# EAGLE board sparrow (EAGLE 6.5.0), part 1 of 2
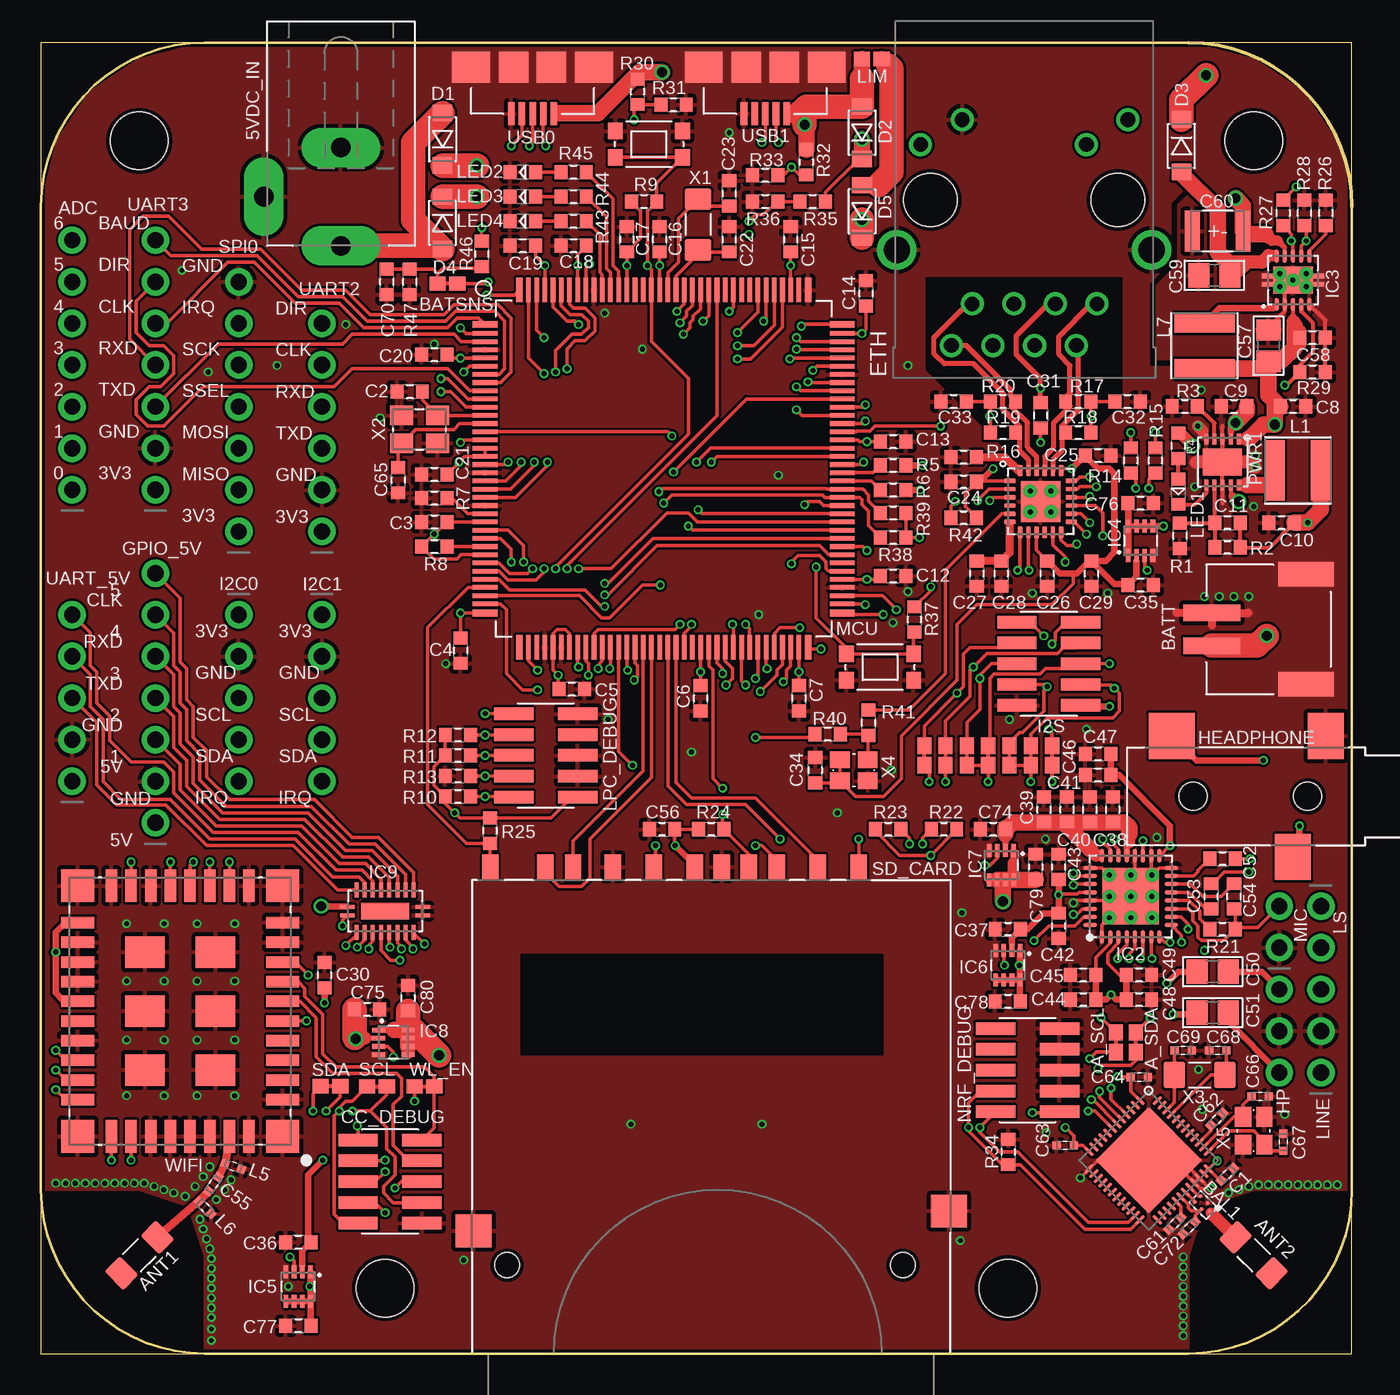
[diagram p10: board, top side]
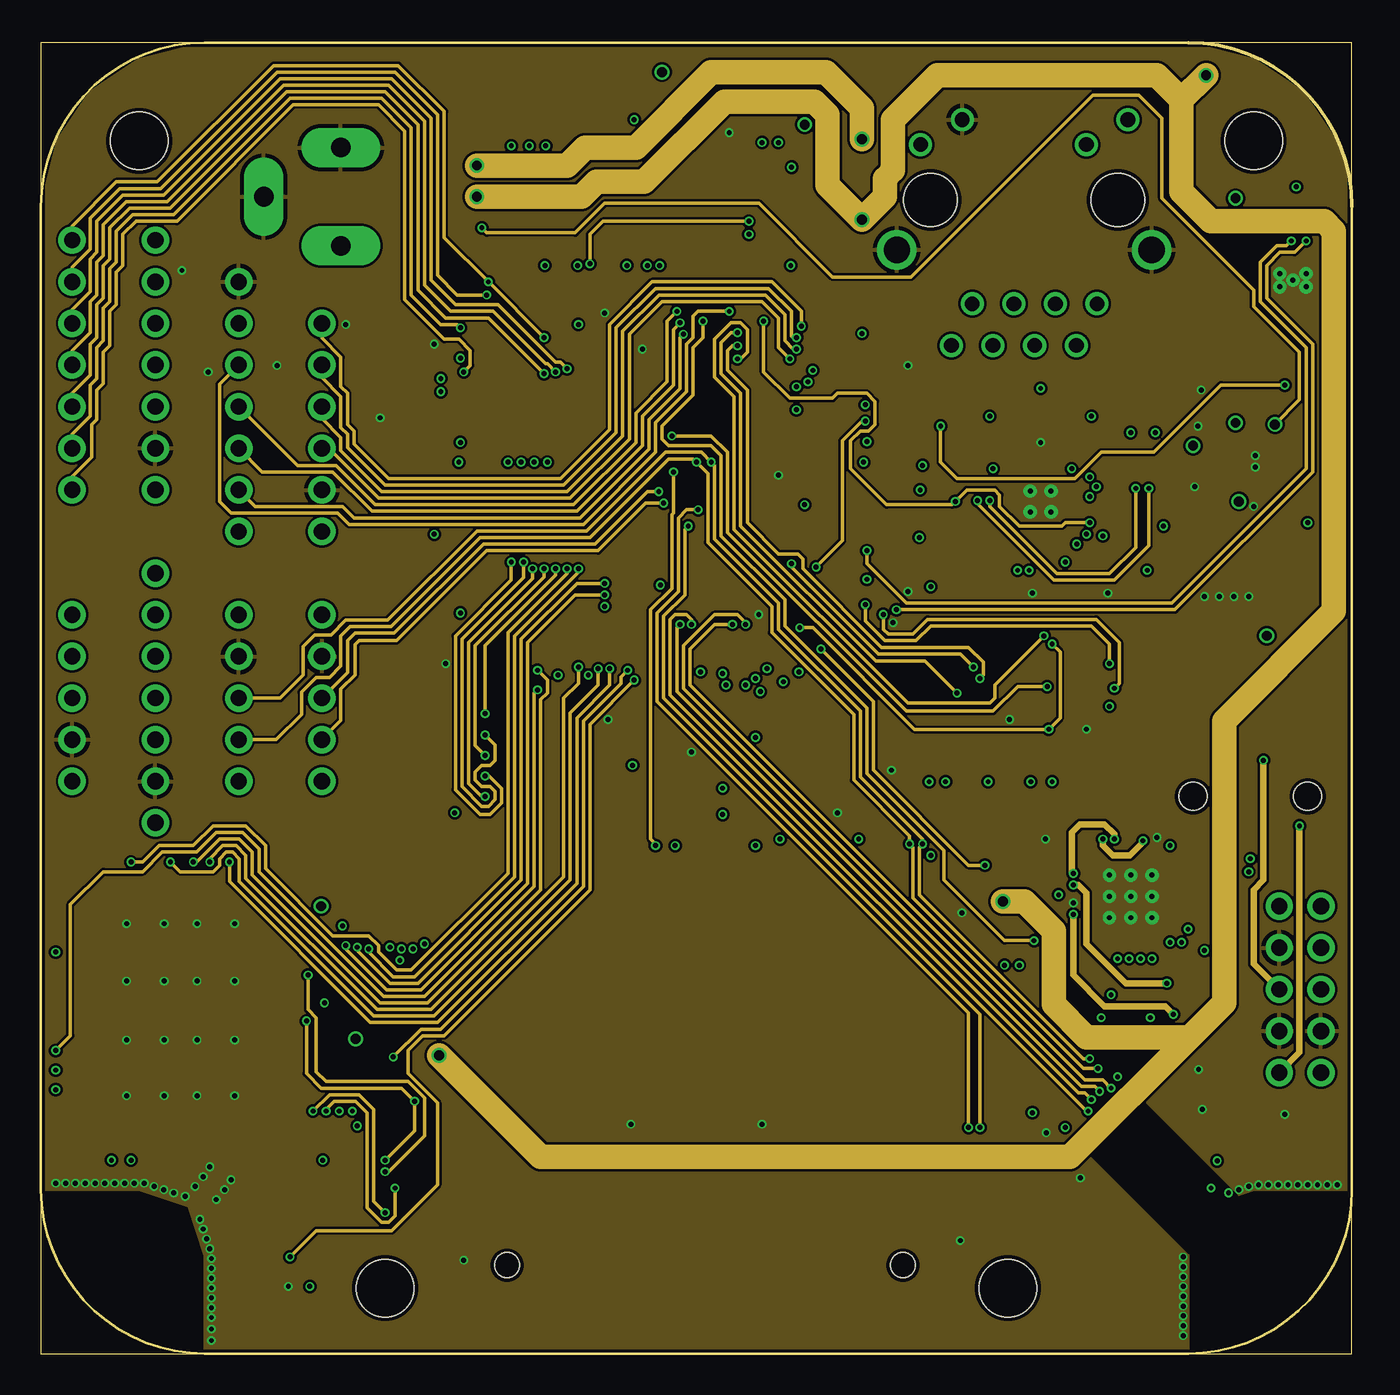
[diagram p11: board, inner layer Route2]
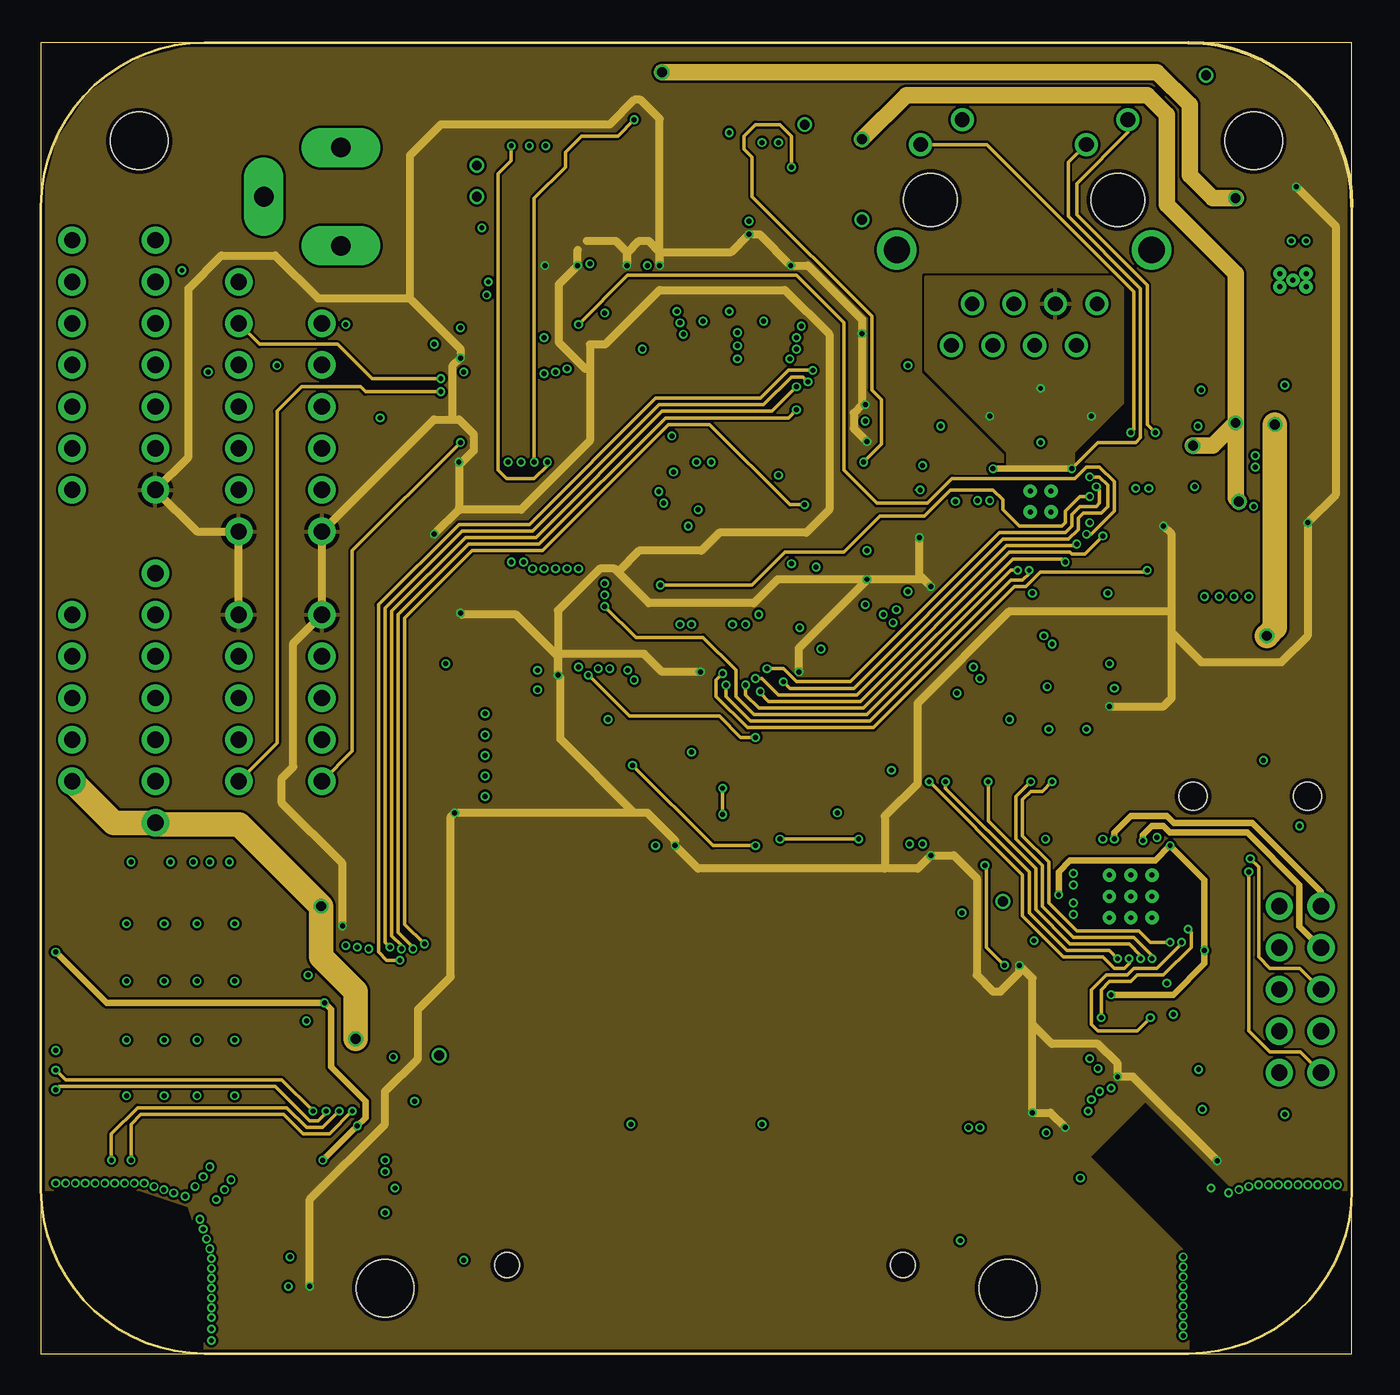
[diagram p12: board, inner layer Route15]
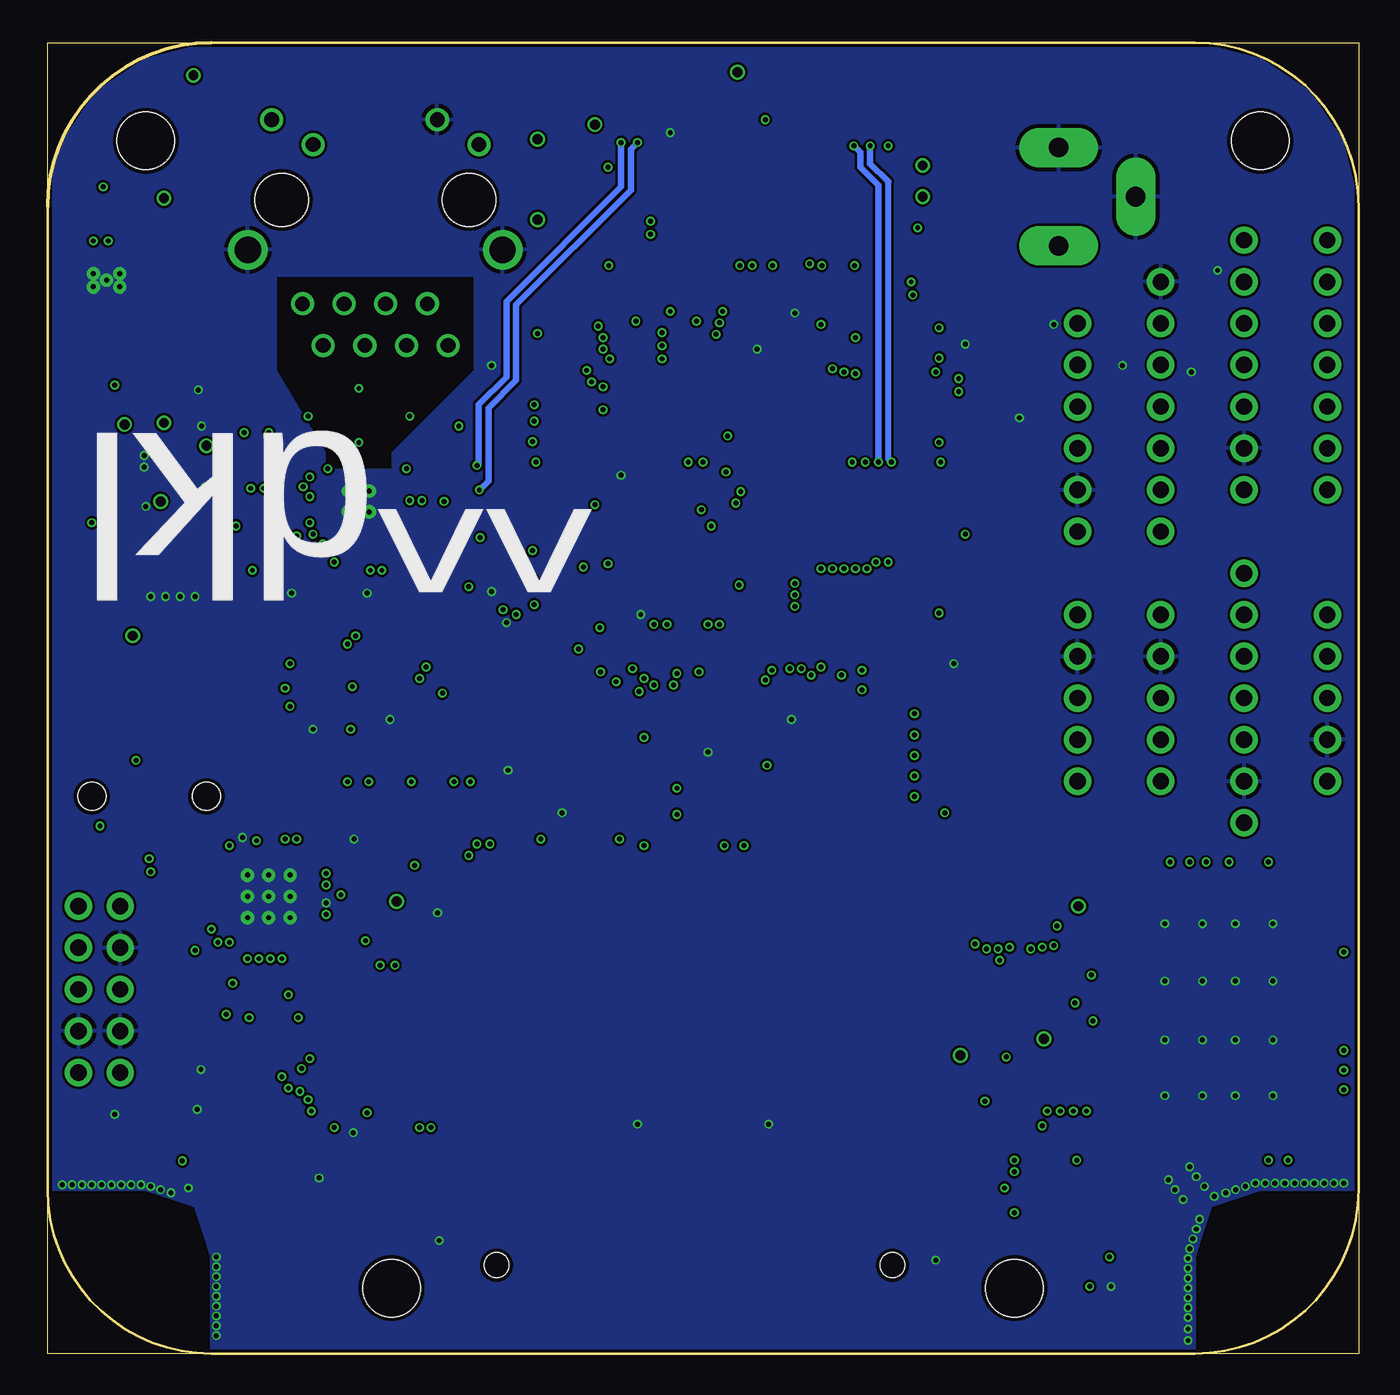
[diagram p13: board, bottom side, seen from below]

Size 80 x 80 mm. Coordinates in mm from the lower left corner, seen from the top.
Outline: 0,0 80,0 80,80 0,80 0,0
Copper layers (1+2*15+16): Top 0.035mm / dielectric 0.2mm / Route2 0.035mm / dielectric 0.55mm / Route15 0.035mm / dielectric 0.2mm / Bottom 0.035mm
Design rules "default *": minimum track width 0.15mm, minimum drill 0.3mm, track to track 0.15mm, track to pad 0.15mm, pad to pad 0.15mm, via to via 0.15mm, smd to smd 0.15mm, copper to edge 10mil, drill to drill 8mil, minimum pad ring 10mil, minimum via ring 4.5mil, stop-mask expansion 3mil, vias tented up to drill 0.61mm, thermal gap 10mil
Net classes: 1 supply2000: width 0.2 mm, drill 0.3 mm; 2 supply500: width 0.2 mm, drill 0.3 mm
Holes 3.5 mm at 6,74 59,4 21,4 74,74
Milling: 8 lines

## Footprints (pad centres in the part's own frame; a part is rotated, then mirrored left to right if it is on the bottom)
CUI_PJ_102BH = drill 1.2 pad 2.4 long: 1 -3,0; 2 0,-4.699; 3 3,0
CK-KMR2 = smd 1 x 0.9: P$1 -0.8,2.05; P$2 -0.8,-2.05; P$3 0.8,2.05; P$4 0.8,-2.05
0603_SOLDERJUMPER_CLOSED = smd 1 x 0.86: 1 -0.6,0; 2 0.6,0
1X07_ROUND = drill 1 pad 1.676: 1 -7.62,0; 2 -5.08,0; 3 -2.54,0; 4 0,0; 5 2.54,0; 6 5.08,0; 7 7.62,0
1206_MINIMELF_COMBO = smd 1.3 x 1.6: 1 -1.55,0; 2 1.55,0
ST_BAL_WLCSP = smd 0.25 x 0.25: DIFF1 -0.6,0.25; DIFF2 -0.6,-0.25; GND 0,0.25; SE 0.433,0; VCC 0,-0.25
S2B-PH-SM4-TB = smd 1 x 3.5: 1 1,-4.25; 2 -1,-4.25 | smd 1.5 x 3.4: 3 -3.35,1.5; 4 3.35,1.5
0402 = smd 0.5 x 0.5: P$1 -0.525,0; P$2 0.525,0
0603 = smd 0.787 x 0.864: 1 -0.775,0; 2 0.775,0
0805 = smd 1.3 x 1.5: 1 -0.95,0; 2 0.95,0
1210_POLAR = smd 0.9 x 2.5: A -1.55,0; K 1.55,0
2X05_SMT = smd 0.762 x 2.4: 1 -2.54,-1.95; 2 -2.54,1.95; 3 -1.27,-1.95; 4 -1.27,1.95; 5 0,-1.95; 6 0,1.95; 7 1.27,-1.95; 8 1.27,1.95; 9 2.54,-1.95; 10 2.54,1.95
SOD123FL = smd 1 x 1.2: A -1.6,0; K 1.6,0
RJ45-RB1-125BAG1A = drill 1.6: CHASSIS@1 -7.775,3.05; CHASSIS@2 7.775,3.05 | drill 0.9: L1 6.325,-3.38; L2 3.785,-4.9; L3 -3.785,-3.38; L4 -6.325,-4.9; R1 -4.445,6.34; R2 -3.175,8.88; R3 -1.905,6.34; R4 -0.635,8.88; R5 0.635,6.34; R6 1.905,8.88; R7 3.175,6.34; R8 4.445,8.88 | hole 3.25: -5.715,0; 5.715,0
CUI_SJ_3523_SMT = smd 2.2 x 2.8: 1 -1.1,-3.7; 3 0.9,3.7 | smd 2.8 x 2.8: 2 8.3,-3.7 | hole 1.7: 0,0; 7,0
1X03_ROUND = drill 1 pad 1.676: 1 -2.54,0; 2 0,0; 3 2.54,0
1X05_ROUND = drill 1 pad 1.676: 1 -5.08,0; 2 -2.54,0; 3 0,0; 4 2.54,0; 5 5.08,0
QFN24-0.5-EP-VIAS = smd 0.69 x 0.28: 1 -1.883,1.25; 2 -1.883,0.75; 3 -1.883,0.25; 4 -1.883,-0.25; 5 -1.883,-0.75; 6 -1.883,-1.25; 13 1.883,-1.25; 14 1.883,-0.75; 15 1.883,-0.25; 16 1.883,0.25; 17 1.883,0.75; 18 1.883,1.25 | smd 0.28 x 0.69: 7 -1.25,-1.883; 8 -0.75,-1.883; 9 -0.25,-1.883; 10 0.25,-1.883; 11 0.75,-1.883; 12 1.25,-1.883; 19 1.25,1.883; 20 0.75,1.883; 21 0.25,1.883; 22 -0.25,1.883; 23 -0.75,1.883; 24 -1.25,1.883 | drill 0.3: P$1 0.635,0.635; P$2 -0.635,0.635; P$3 -0.635,-0.635; P$4 0.635,-0.635 | smd 2.5 x 2.5: PAD 0,0
QFN32-0.5-EP-VIAS = smd 0.85 x 0.28: 1 -2.475,1.75; 2 -2.475,1.25; 3 -2.475,0.75; 4 -2.475,0.25; 5 -2.475,-0.25; 6 -2.475,-0.75; 7 -2.475,-1.25; 8 -2.475,-1.75; 17 2.475,-1.75; 18 2.475,-1.25; 19 2.475,-0.75; 20 2.475,-0.25; 21 2.475,0.25; 22 2.475,0.75; 23 2.475,1.25; 24 2.475,1.75 | smd 0.28 x 0.85: 9 -1.75,-2.475; 10 -1.25,-2.475; 11 -0.75,-2.475; 12 -0.25,-2.475; 13 0.25,-2.475; 14 0.75,-2.475; 15 1.25,-2.475; 16 1.75,-2.475; 25 1.75,2.475; 26 1.25,2.475; 27 0.75,2.475; 28 0.25,2.475; 29 -0.25,2.475; 30 -0.75,2.475; 31 -1.25,2.475; 32 -1.75,2.475 | smd 3.45 x 3.45: PAD 0,0 | drill 0.3: VIA1 -1.3,1.3; VIA2 0,1.3; VIA3 1.3,1.3; VIA4 -1.3,0; VIA5 0,0; VIA6 1.3,0; VIA7 -1.3,-1.3; VIA8 0,-1.3; VIA9 1.3,-1.3
SON10-0.5-EP-VIAS = smd 0.23 x 0.8: 1 -1,-1.475; 2 -0.5,-1.475; 3 0,-1.475; 4 0.5,-1.475; 5 1,-1.475; 6 1,1.475; 7 0.5,1.475; 8 0,1.475; 9 -0.5,1.475; 10 -1,1.475 | smd 0.7 x 0.28: EXT1 -1.55,0.25; EXT2 1.55,0.25; EXT3 -1.55,-0.25; EXT4 1.55,-0.25 | smd 2.4 x 1.65: PAD 0,0 | drill 0.3: THERM1 -0.8,0.4; THERM2 0.8,0.4; THERM3 0,0; THERM4 -0.8,-0.4; THERM5 0.8,-0.4
SC70JW-8-NOTHERMALS = smd 0.8 x 0.28: 1 -0.9,0.75; 2 -0.9,0.25; 3 -0.9,-0.25; 4 -0.9,-0.75; 5 0.9,-0.75; 6 0.9,-0.25; 7 0.9,0.25; 8 0.9,0.75
FXMA108 = smd 0.9 x 0.24: 1 -2.3,-0.25; 10 2.3,-0.25; 11 2.3,0.25; 20 -2.3,0.25 | smd 0.24 x 0.9: 2 -1.75,-1.3; 3 -1.25,-1.3; 4 -0.75,-1.3; 5 -0.25,-1.3; 6 0.25,-1.3; 7 0.75,-1.3; 8 1.25,-1.3; 9 1.75,-1.3; 12 1.75,1.3; 13 1.25,1.3; 14 0.75,1.3; 15 0.25,1.3; 16 -0.25,1.3; 17 -0.75,1.3; 18 -1.25,1.3; 19 -1.75,1.3 | smd 2.9 x 1: EP 0,0
INDUCTOR_40X40 = smd 1.2 x 3.7: P$1 -1.4,0; P$2 1.4,0
0603_POLAR = smd 0.787 x 0.864: A -0.775,0; K 0.775,0
0603_SOLDERJUMPER_OPEN = smd 1 x 0.86: 1 -0.6,0; 2 0.6,0
1X02_ROUND = drill 1 pad 1.676: 1 -1.27,0; 2 1.27,0
QFP144-0.5 = smd 1.5 x 0.4: 1 -10.9,8.81; 36 -10.9,-8.81; 73 10.9,-8.81; 108 10.9,8.81 | smd 1.5 x 0.28: 2 -10.9,8.25; 3 -10.9,7.75; 4 -10.9,7.25; 5 -10.9,6.75; 6 -10.9,6.25; 7 -10.9,5.75; 8 -10.9,5.25; 9 -10.9,4.75; 10 -10.9,4.25; 11 -10.9,3.75; 12 -10.9,3.25; 13 -10.9,2.75; 14 -10.9,2.25; 15 -10.9,1.75; 16 -10.9,1.25; 17 -10.9,0.75; 18 -10.9,0.25; 19 -10.9,-0.25; 20 -10.9,-0.75; 21 -10.9,-1.25; 22 -10.9,-1.75; 23 -10.9,-2.25; 24 -10.9,-2.75; 25 -10.9,-3.25; 26 -10.9,-3.75; 27 -10.9,-4.25; 28 -10.9,-4.75; 29 -10.9,-5.25; 30 -10.9,-5.75; 31 -10.9,-6.25; 32 -10.9,-6.75; 33 -10.9,-7.25; 34 -10.9,-7.75; 35 -10.9,-8.25; 74 10.9,-8.25; 75 10.9,-7.75; 76 10.9,-7.25; 77 10.9,-6.75; 78 10.9,-6.25; 79 10.9,-5.75; 80 10.9,-5.25; 81 10.9,-4.75; 82 10.9,-4.25; 83 10.9,-3.75; 84 10.9,-3.25; 85 10.9,-2.75; 86 10.9,-2.25; 87 10.9,-1.75; 88 10.9,-1.25; 89 10.9,-0.75; 90 10.9,-0.25; 91 10.9,0.25; 92 10.9,0.75; 93 10.9,1.25; 94 10.9,1.75; 95 10.9,2.25; 96 10.9,2.75; 97 10.9,3.25; 98 10.9,3.75; 99 10.9,4.25; 100 10.9,4.75; 101 10.9,5.25; 102 10.9,5.75; 103 10.9,6.25; 104 10.9,6.75; 105 10.9,7.25; 106 10.9,7.75; 107 10.9,8.25 | smd 0.4 x 1.5: 37 -8.81,-10.9; 72 8.81,-10.9; 109 8.81,10.9; 144 -8.81,10.9 | smd 0.28 x 1.5: 38 -8.25,-10.9; 39 -7.75,-10.9; 40 -7.25,-10.9; 41 -6.75,-10.9; 42 -6.25,-10.9; 43 -5.75,-10.9; 44 -5.25,-10.9; 45 -4.75,-10.9; 46 -4.25,-10.9; 47 -3.75,-10.9; 48 -3.25,-10.9; 49 -2.75,-10.9; 50 -2.25,-10.9; 51 -1.75,-10.9; 52 -1.25,-10.9; 53 -0.75,-10.9; 54 -0.25,-10.9; 55 0.25,-10.9; 56 0.75,-10.9; 57 1.25,-10.9; 58 1.75,-10.9; 59 2.25,-10.9; 60 2.75,-10.9; 61 3.25,-10.9; 62 3.75,-10.9; 63 4.25,-10.9; 64 4.75,-10.9; 65 5.25,-10.9; 66 5.75,-10.9; 67 6.25,-10.9; 68 6.75,-10.9; 69 7.25,-10.9; 70 7.75,-10.9; 71 8.25,-10.9; 110 8.25,10.9; 111 7.75,10.9; 112 7.25,10.9; 113 6.75,10.9; 114 6.25,10.9; 115 5.75,10.9; 116 5.25,10.9; 117 4.75,10.9; 118 4.25,10.9; 119 3.75,10.9; 120 3.25,10.9; 121 2.75,10.9; 122 2.25,10.9; 123 1.75,10.9; 124 1.25,10.9; 125 0.75,10.9; 126 0.25,10.9; 127 -0.25,10.9; 128 -0.75,10.9; 129 -1.25,10.9; 130 -1.75,10.9; 131 -2.25,10.9; 132 -2.75,10.9; 133 -3.25,10.9; 134 -3.75,10.9; 135 -4.25,10.9; 136 -4.75,10.9; 137 -5.25,10.9; 138 -5.75,10.9; 139 -6.25,10.9; 140 -6.75,10.9; 141 -7.25,10.9; 142 -7.75,10.9; 143 -8.25,10.9
QFN48_EP = smd 0.7 x 0.2: 1 -2.95,2.2; 2 -2.95,1.8; 3 -2.95,1.4; 4 -2.95,1; 5 -2.95,0.6; 6 -2.95,0.2; 7 -2.95,-0.2; 8 -2.95,-0.6; 9 -2.95,-1; 10 -2.95,-1.4; 11 -2.95,-1.8; 12 -2.95,-2.2; 25 2.95,-2.2; 26 2.95,-1.8; 27 2.95,-1.4; 28 2.95,-1; 29 2.95,-0.6; 30 2.95,-0.2; 31 2.95,0.2; 32 2.95,0.6; 33 2.95,1; 34 2.95,1.4; 35 2.95,1.8; 36 2.95,2.2 | smd 0.2 x 0.7: 13 -2.2,-2.95; 14 -1.8,-2.95; 15 -1.4,-2.95; 16 -1,-2.95; 17 -0.6,-2.95; 18 -0.2,-2.95; 19 0.2,-2.95; 20 0.6,-2.95; 21 1,-2.95; 22 1.4,-2.95; 23 1.8,-2.95; 24 2.2,-2.95; 37 2.2,2.95; 38 1.8,2.95; 39 1.4,2.95; 40 1,2.95; 41 0.6,2.95; 42 0.2,2.95; 43 -0.2,2.95; 44 -0.6,2.95; 45 -1,2.95; 46 -1.4,2.95; 47 -1.8,2.95; 48 -2.2,2.95 | smd 4.6 x 4.6: PAD 0,0
LTC4080_DFN = smd 0.675 x 0.25: 1 -1.413,1; 2 -1.413,0.5; 3 -1.413,0; 4 -1.413,-0.5; 5 -1.413,-1; 6 1.413,-1; 7 1.413,-0.5; 8 1.413,0; 9 1.413,0.5; 10 1.413,1 | smd 1.65 x 2.38: 11 0,0
AMPHENO_101_00313_EXT_PADS = smd 1.5 x 1: 1 -24.31,6.1; 2 -24.31,3.6; 3 -24.31,0.25; 4 -24.31,-1.4; 5 -24.31,-3.9; 6 -24.31,-6.4; 7 -24.31,-8.83; 8 -24.31,-10.53; 9 -24.31,8.6; CD -24.31,1.9; WP -24.31,-13.88 | smd 2 x 2.2: GND1 -2.1,-14.9; GND2 -3.3,14.1 | hole 1.5: 0,11.3; 0,-12.85
1X06_ROUND = drill 1 pad 1.676: 1 -6.35,0; 2 -3.81,0; 3 -1.27,0; 4 1.27,0; 5 3.81,0; 6 6.35,0
USB_MICRO_SMD = smd 0.4 x 1.4: 1_VBUS -1.3,2.85; 2_D- -0.65,2.85; 3_D+ 0,2.85; 4_ID_NC 0.65,2.85; 5_GND 1.3,2.85 | smd 2.3 x 1.9: SHIELD_1 -3.75,0; SHIELD_4 3.75,0 | smd 1.8 x 1.9: SHIELD_2 -1.15,0; SHIELD_3 1.15,0
CC3000-EXT = smd 2 x 0.7: 1 -6.25,5.4; 2 -6.25,4.2; 3 -6.25,3; 4 -6.25,1.8; 5 -6.25,0.6; 6 -6.25,-0.6; 7 -6.25,-1.8; 8 -6.25,-3; 9 -6.25,-4.2; 10 -6.25,-5.4; 19 6.25,-5.4; 20 6.25,-4.2; 21 6.25,-3; 22 6.25,-1.8; 23 6.25,-0.6; 24 6.25,0.6; 25 6.25,1.8; 26 6.25,3; 27 6.25,4.2; 28 6.25,5.4 | smd 0.7 x 2: 11 -4.2,-7.65; 12 -3,-7.65; 13 -1.8,-7.65; 14 -0.6,-7.65; 15 0.6,-7.65; 16 1.8,-7.65; 17 3,-7.65; 18 4.2,-7.65; 29 4.2,7.65; 30 3,7.65; 31 1.8,7.65; 32 0.6,7.65; 33 -0.6,7.65; 34 -1.8,7.65; 35 -3,7.65; 36 -4.2,7.65 | smd 2.4 x 1.9: 37 -2.15,3.6; 38 -2.15,0; 39 -2.15,-3.6; 40 2.15,3.6; 41 2.15,0; 42 2.15,-3.6 | smd 2 x 2: 43 -6.25,7.65; 44 -6.25,-7.65; 45 6.25,-7.65; 46 6.25,7.65
ABM8G = smd 1.397 x 1.194: 1 -1.105,-0.851; 2 1.105,-0.851; 3 1.105,0.851; 4 -1.105,0.851
CRYSTAL25X20 = smd 1.2 x 1: 1 -0.85,-0.65; 2 0.85,-0.65; 3 0.85,0.65; 4 -0.85,0.65

## Placement (x,y rotation side)
5VDC_IN  2A max  [CUI_PJ_102BH]  18.3,70.6 270 top
!PGM  PUSHBUTTONKMR2XX  [CK-KMR2]  51.2,41.9 90 top
A_SCL  JUMPERSOLDER_CLOSED  [0603_SOLDERJUMPER_CLOSED]  65.6,19 90 top
A_SDA  JUMPERSOLDER_CLOSED  [0603_SOLDERJUMPER_CLOSED]  66.8,19 90 top
ADC  HEADER-1X7ROUND  [1X07_ROUND]  1.91,60.33 90 top
ANT1  2.4GHz 50Ω  [1206_MINIMELF_COMBO]  6,6 225 top
ANT2  2.4GHz 50Ω  [1206_MINIMELF_COMBO]  74,6 315 top
BAL1  BALUNWLCSP  [ST_BAL_WLCSP]  71,9 315 top
BATSNS  JUMPERSOLDER_CLOSED  [0603_SOLDERJUMPER_CLOSED]  24.8,65.3 180 top
BATT  BATTERY_WITH_HOLDER  [S2B-PH-SM4-TB]  75.7,44.2 270 top
C1  1n  [0402]  72.4,10.94 45 top
C2  18p  [0603]  22.5,58.7 180 top
C3  100n  [0603]  24,50.75 180 top
C4  100n  [0603]  25.61,42.9 270 top
C5  100n  [0603]  32.4,40.55 0 top
C6  100n  [0603]  40.25,40 270 top
C7  100n  [0603]  46.25,40 270 top
C8  4.7u  [0603]  76.4,57.8 0 top
C9  4.7u  [0603]  72.8,57.8 180 top
C10  4.7u  [0603]  75.7,50.7 180 top
C11  10p  [0603]  72.4,50.7 180 top
C12  100n  [0603]  52,47.45 0 top
C13  100n  [0603]  52,55.65 0 top
C14  100n  [0603]  50.35,64.7 90 top
C15  100n  [0603]  45.75,68 90 top
C16  100n  [0603]  37.75,68 90 top
C17  100n  [0603]  35.75,68 90 top
C18  100n  [0603]  32.5,67.6 180 top
C19  100n  [0603]  29.4,67.6 180 top
C20  100n  [0603]  24,60.95 180 top
C21  100n  [0603]  24,53.65 180 top
C22  18p  [0603]  42,68 90 top
C23  18p  [0603]  42,70.8 90 top
C24  10n  [0603]  56.3,53.2 180 top
C25  10n  [0603]  64.5,54.8 0 top
C26  10n  [0603]  61.4,47.6 270 top
C27  1u  [0603]  57.1,47.6 270 top
C28  470p  [0603]  58.6,47.6 270 top
C29  10u  [0603]  64.1,47.6 270 top
C30  100n  [0603]  17.3,23.1 90 top
C31  100n  [0603]  61,57.25 270 top
C32  100n  [0603]  66.3,58.1 0 top
C33  100n  [0603]  55.7,58.1 180 top
C34  100n  [0603]  47.25,35.6 90 top
C35  100n  [0603]  67.1,46.9 0 top
C36  100n  [0603]  15.7,6.8 180 top
C37  100n  [0603]  59,25.9 180 top
C38  100n  [0603]  65.4,33.2 90 top
C39  100n  [0603]  61.2,33.2 90 top
C40  22u  [0603]  64,33.2 90 top
C41  22u  [0603]  62.6,33.2 90 top
C42  10u  [0603]  62.1,26.1 270 top
C43  100n  [0603]  62.1,29.7 90 top
C44  10u  [0603]  63.6,21.6 180 top
C45  100n  [0603]  63.6,23.1 180 top
C46  10u  [0603]  64.5,35.3 180 top
C47  100n  [0603]  64.5,36.6 180 top
C48  10u  [0603]  67,21.6 0 top
C49  100n  [0603]  67,23.1 0 top
C50  47u  [0805]  71.5,23.3 0 top
C51  47u  [0805]  71.5,20.8 0 top
C52  1u  [0603]  72.1,30.2 180 top
C53  1u  [0603]  71.4,27.9 270 top
C54  100n  [0603]  72.8,27.9 90 top
C55  2.2p  [0402]  10.52,10.34 235 top
C56  1u  [0603]  37.9,32 180 top
C57  22u 10V  [0805]  74.9,61.5 90 top
C58  100n  [0603]  77.6,62 0 top
C59  22u 10V  [0805]  71.6,65.8 180 top
C60  150u 10V  [1210_POLAR]  71.8,68.5 180 top
C61  47n  [0402]  69.2,7.94 225 top
C62  100n  [0402]  71.76,14.3 45 top
C63  100n  [0402]  62.5,12.7 180 top
C64  100n  [0402]  67.02,16.87 0 top
C65  18p  [0603]  21.8,53.3 270 top
C66  12p  [0402]  74.4,15.7 0 top
C67  12p  [0402]  75.8,12.9 90 top
C68  9p  [0402]  71.8,18.5 0 top
C69  9p  [0402]  69.7,18.5 180 top
C70  100n  [0603]  21.1,65.4 270 top
C72  2.2n  [0402]  70.06,7.68 45 top
C74  100n  [0603]  58.1,32 180 top
C75  100n  [0603]  19.9,21 0 top
C76  1u  [0603]  67.1,51.9 0 top
C77  1u  [0603]  15.7,1.7 180 top
C78  1u  [0603]  59,21.5 180 top
C79  1u  [0603]  60.7,29.7 90 top
C80  1u  [0603]  22.4,21.7 90 top
CC_DEBUG  HEADER-2X5SMD-1.27MM  [2X05_SMT]  21.3,10.5 270 top
D1  MBR230LSFT1  [SOD123FL]  24.5,74.1 270 top
D2  MBR230LSFT1  [SOD123FL]  50.1,74.5 270 top
D3  MBR230LSFT1  [SOD123FL]  69.6,73.7 90 top
D4  MBR230LSFT1  [SOD123FL]  24.5,69 90 top
D5  MBR230LSFT1  [SOD123FL]  50.1,69.7 270 top
ETH  ETHERNET_JACK_LEDSRB1-125BAG1A  [RJ45-RB1-125BAG1A]  60,70.4 180 top
GPIO_5V  HEADER-1X7ROUND  [1X07_ROUND]  6.99,40.01 90 top
HEADPHONE  AUDIOJACK-STEREO-3PCUI_SJ_3523  [CUI_SJ_3523_SMT]  77.3,34 180 top
HP  HP  [1X03_ROUND]  75.56,19.68 270 top
I2C0  I2C0  [1X05_ROUND]  12.06,40.01 270 top
I2C1  I2C1  [1X05_ROUND]  17.14,40.01 270 top
I2S  HEADER-2X5SMD-1.27MM  [2X05_SMT]  61.5,42.1 90 top
IC1  LAN8720AVIAS  [QFN24-0.5-EP-VIAS]  61,52 0 top
IC2  TLV320AIC3100VIAS  [QFN32-0.5-EP-VIAS]  66.5,27.9 90 top
IC3  TPS2500  [SON10-0.5-EP-VIAS]  76.4,65.5 0 top
IC4  SKYWORKS_AAT4280ASC70JW-8-NOTHERMALS  [SC70JW-8-NOTHERMALS]  67.1,49.6 90 top
IC5  SKYWORKS_AAT4280ASC70JW-8-NOTHERMALS  [SC70JW-8-NOTHERMALS]  15.7,4.1 270 top
IC6  SKYWORKS_AAT4280ASC70JW-8-NOTHERMALS  [SC70JW-8-NOTHERMALS]  59,23.7 270 top
IC7  SKYWORKS_AAT4280ASC70JW-8-NOTHERMALS  [SC70JW-8-NOTHERMALS]  58.6,29.8 270 top
IC8  SKYWORKS_AAT4280ASC70JW-8-NOTHERMALS  [SC70JW-8-NOTHERMALS]  21.5,19 0 top
IC9  FXMA10820-DFN  [FXMA108]  21,27 0 top
L1  10u  [INDUCTOR_40X40]  76.7,53.9 0 top
L5  2.2n  [0402]  11.73,11.43 160 top
L6  DNP  [0402]  10.01,8.92 135 top
L7  2.2u  [INDUCTOR_40X40]  71,61.5 90 top
LED1  CHARGE  [0603_POLAR]  69.4,52.6 270 top
LED2  [0603_POLAR]  29.4,72.1 180 top
LED3  [0603_POLAR]  29.4,70.6 180 top
LED4  [0603_POLAR]  29.4,69.1 180 top
LIM  JUMPERSOLDER_OPEN  [0603_SOLDERJUMPER_OPEN]  50.7,79 0 top
LINE  LINE  [1X03_ROUND]  78.11,19.68 90 top
LOGO2  LOGOKRONE  [LOGO-KRONE]  50.6,30 180 bottom
LOGO3  LOGOKRONE  [LOGO-KRONE]  31.6,30 180 bottom
LOGO4  LOGOKRONE  [LOGO-KRONE]  12.6,30 180 bottom
LPC_DEBUG  DEBUG  [2X05_SMT]  30.8,36.5 90 top
LS  LS  [1X02_ROUND]  78.11,26.04 270 top
MCLK  JUMPERSOLDER_CLOSED  [0603_SOLDERJUMPER_CLOSED]  61.7,36.5 270 top
MCU  LPC1837  [QFP144-0.5]  38,54 0 top
MCU1  NRF51822QFN48  [QFN48_EP]  67.6,11.8 315 top
MIC  MIC  [1X02_ROUND]  75.56,26.04 90 top
NRF_DEBUG  HEADER-2X5SMD-1.27MM  [2X05_SMT]  60.2,17.3 90 top
PWR1  LTC4080DFN  [LTC4080_DFN]  72.1,54.4 270 top
R1  768K  [0603]  69.5,49.9 90 top
R2  2.4M  [0603]  72.4,49.2 0 top
R3  806  [0603]  69.8,57.8 0 top
R4  1K  [0603]  69.4,55.4 90 top
R5  33  [0603]  52,54.2 0 top
R6  33  [0603]  52,52.7 0 top
R7  12K 1%  [0603]  24,52.2 180 top
R8  10K  [0603]  24,49.25 180 top
R9  10K  [0603]  36.8,70.3 180 top
R10  10K  [0603]  25.45,34 180 top
R11  10K  [0603]  25.45,36.5 180 top
R12  10K  [0603]  25.45,37.75 180 top
R13  10K  [0603]  25.45,35.25 0 top
R14  330  [0603]  66.5,54.5 270 top
R15  330  [0603]  68,54.5 270 top
R16  12.1K  [0603]  56.3,54.7 0 top
R17  49.9 1%  [0603]  63.3,58.1 0 top
R18  49.9 1%  [0603]  63.3,56.2 180 top
R19  49.9 1%  [0603]  58.7,56.2 180 top
R20  49.9 1%  [0603]  58.7,58.1 0 top
R21  2.2K  [0603]  72.1,25.9 180 top
R22  2.2K  [0603]  55.1,32 0 top
R23  2.2K  [0603]  51.7,32 180 top
R24  100K  [0603]  40.9,32 180 top
R25  100K  [0603]  27.4,31.9 90 top
R26  40.2K  [0603]  78.4,69.6 270 top
R27  100K  [0603]  75.8,69.6 90 top
R28  100K  [0603]  77.1,69.6 270 top
R29  100K  [0603]  77.6,59.9 180 top
R30  10K  [0603]  36.4,77 90 top
R31  100K  [0603]  38.6,76.2 180 top
R32  10K  [0603]  46.7,72.7 90 top
R33  100K  [0603]  44.2,71.9 0 top
R34  100K  [0603]  59.02,12.31 270 top
R35  100K  [0603]  47.1,70.3 0 top
R36  100K  [0603]  44.2,70.3 0 top
R37  100K  [0603]  53.3,44.8 90 top
R38  2.2K  [0603]  52,49.8 0 top
R39  2.2K  [0603]  52,51.3 0 top
R40  33  [0603]  48,37.8 0 top
R41  33  [0603]  50.5,38.5 90 top
R42  10K  [0603]  56.3,51 0 top
R43  1K  [0603]  32.5,70.6 180 top
R44  1K  [0603]  32.5,69.1 180 top
R45  1K  [0603]  32.5,72.1 180 top
R46  768K  [0603]  26.9,67.1 90 top
R47  768K  [0603]  22.5,65.4 90 top
RESET  PUSHBUTTONKMR2XX  [CK-KMR2]  37.1,73.8 270 top
RX_SCK  JUMPERSOLDER_CLOSED  [0603_SOLDERJUMPER_CLOSED]  60.4,36.5 270 top
RX_SD  JUMPERSOLDER_CLOSED  [0603_SOLDERJUMPER_CLOSED]  55.2,36.5 270 top
RX_WS  JUMPERSOLDER_CLOSED  [0603_SOLDERJUMPER_CLOSED]  57.8,36.5 270 top
SCL  [0603_SOLDERJUMPER_CLOSED]  20.5,16.3 180 top
SD_CARD  SD_CARDEXTENDED  [AMPHENO_101_00313_EXT_PADS]  41.3,5.4 270 top
SDA  JUMPERSOLDER_CLOSED  [0603_SOLDERJUMPER_CLOSED]  17.66,16.32 180 top
SPI0  HEADER-1X7ROUND  [1X07_ROUND]  12.06,57.78 90 top
TX_SCK  JUMPERSOLDER_CLOSED  [0603_SOLDERJUMPER_CLOSED]  59.1,36.5 270 top
TX_SD  JUMPERSOLDER_CLOSED  [0603_SOLDERJUMPER_CLOSED]  53.9,36.5 270 top
TX_WS  JUMPERSOLDER_CLOSED  [0603_SOLDERJUMPER_CLOSED]  56.5,36.5 270 top
UART2  UART2  [1X06_ROUND]  17.14,56.52 90 top
UART3  HEADER-1X7ROUND  [1X07_ROUND]  6.99,60.33 90 top
UART_5V  UART_5V  [1X05_ROUND]  1.91,40.01 90 top
USB0  USB_MICROSMD  [USB_MICRO_SMD]  30,78.5 180 top
USB1  USB_MICROSMD  [USB_MICRO_SMD]  44.2,78.5 180 top
WIFI  CC3000EXTENDED  [CC3000-EXT]  8.5,20.9 180 top
WL_EN  JUMPERSOLDER_CLOSED  [0603_SOLDERJUMPER_CLOSED]  23.4,16.3 180 top
X1  ABS07-32768  [1206_MINIMELF_COMBO]  40.1,68.9 270 top
X2  12MHz  [ABM8G]  23.1,56.4 0 top
X3  32768  [1206_MINIMELF_COMBO]  70.7,17 0 top
X4  50MHZ  [CRYSTAL25X20]  49.6,35.6 0 top
X5  16MHz  [CRYSTAL25X20]  74,13.6 90 top